# EAGLE schematic schema_12 (EAGLE 9.0.0)
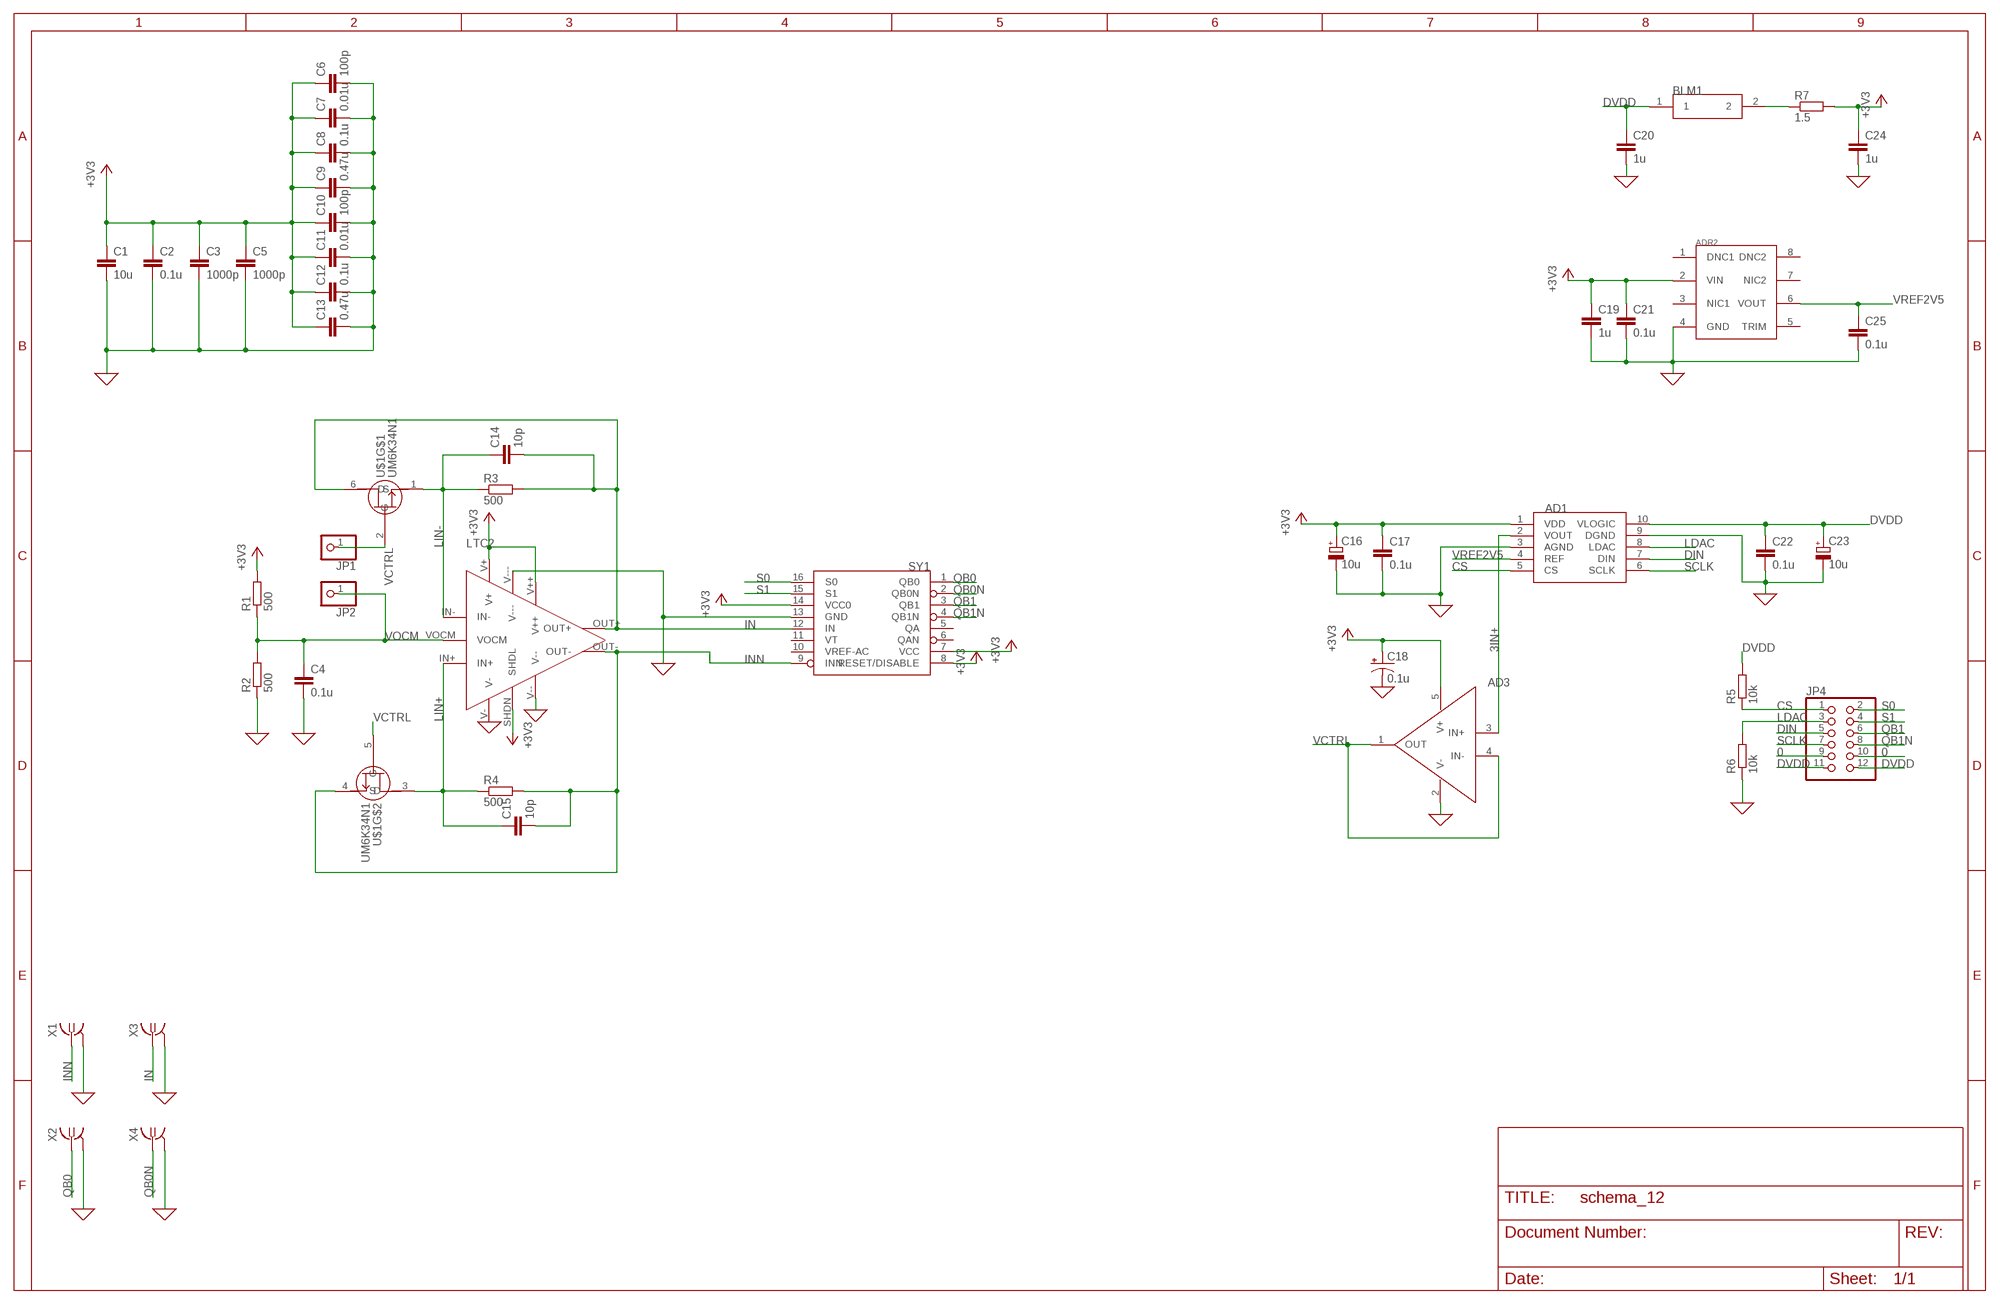
[diagram p0: schematic, sheet 1]

## Parts
AD1  0  AD5541AN  [SOP50P490X110-10]
AD3  0  AD8605N  [SOT95P280X145-5]
ADR2  ADR441N  [SOIC127P600X175-8]
BLM1  0  BLM18EG221TN1D  [C1608]
C1  10u  C-EUC1210  [C1210]
C2  0.1u  C-EUC0603  [C0603]
C3  1000p  C-EUC1206  [C1206]
C4  0.1u  C-EUC0603  [C0603]
C5  1000p  C-EUC1206  [C1206]
C6  100p  C-EUC0805  [C0805]
C7  0.01u  C-EUC1808  [C1808]
C8  0.1u  C-EUC0603  [C0603]
C9  0.47u  C-EUC1210  [C1210]
C10  100p  C-EUC0805  [C0805]
C11  0.01u  C-EUC1808  [C1808]
C12  0.1u  C-EUC0603  [C0603]
C13  0.47u  C-EUC1210  [C1210]
C14  10p  C-EUC0603  [C0603]
C15  10p  C-EUC0603  [C0603]
C16  10u  CPOL-EU153CLV-0405  [153CLV-0405]
C17  0.1u  C-EUC0603  [C0603]
C18  0.1u  CPOL-US153CLV-0405  [153CLV-0405]
C19  1u  C-EUC0603  [C0603]
C20  1u  C-EUC0603  [C0603]
C21  0.1u  C-EUC0603  [C0603]
C22  0.1u  C-EUC0603  [C0603]
C23  10u  CPOL-EU153CLV-0405  [153CLV-0405]
C24  1u  C-EUC0603  [C0603]
C25  0.1u  C-EUC0603  [C0603]
JP1  0  PINHD-1X1  [1X01]
JP2  0  PINHD-1X1  [1X01]
JP4  0  PINHD-2X6/90  [2X06/90]
LTC2  0  LTC6409_1  [LTC6409_1]
R1  500  R-EU_R0603  [R0603]
R2  500  R-EU_R0603  [R0603]
R3  500  R-EU_R0603  [R0603]
R4  500  R-EU_R0603  [R0603]
R5  10k  R-EU_R0805  [R0805]
R6  10k  R-EU_R0805  [R0805]
R7  1.5  R-EU_R0805  [R0805]
SY1  SY89873LN  [QFN50P300X300X90-16]
U$1  UM6K34N1  [SOTFL65P210X100-6]
X1  SMA-142-0701-871/880  [SMA-142-0701-871]
X2  SMA-142-0701-871/880  [SMA-142-0701-871]
X3  SMA-142-0701-871/880  [SMA-142-0701-871]
X4  SMA-142-0701-871/880  [SMA-142-0701-871]

## Nets
0: AD1.3(AGND) AD1.9(DGND) AD3.2(V-) ADR2.4(GND) C1.2 C2.2 C3.2 C4.2 C5.2 C6.2 C7.2 C8.2 C9.2 C10.2 C11.2 C12.2 C13.2 C16.- C17.2 C18.- C19.2 C20.2 C21.2 C22.2 C23.- C24.2 C25.2 JP4.9 JP4.10 LTC2.V- LTC2.V-- LTC2.V--- R2.1 R6.1 SY1.13(GND) X1.2@1 X1.2@2 X1.2@3 X1.2@4 X2.2@1 X2.2@2 X2.2@3 X2.2@4 X3.2@1 X3.2@2 X3.2@3 X3.2@4 X4.2@1 X4.2@2 X4.2@3 X4.2@4 ; supply symbol labelled GND
3IN+: AD1.2(VOUT) AD3.3(IN+)
+3V3: AD1.1(VDD) AD3.5(V+) ADR2.2(VIN) C1.1 C2.1 C3.1 C5.1 C6.1 C7.1 C8.1 C9.1 C10.1 C11.1 C12.1 C13.1 C16.+ C17.1 C18.+ C19.1 C21.1 C24.1 LTC2.SHDN(SHDL) LTC2.V+ LTC2.V++ R1.2 R7.2 SY1.7(VCC) SY1.8(RESET/DISABLE) SY1.14(VCC0)
CS: AD1.5(CS) JP4.1 R5.1
DIN: AD1.7(DIN) JP4.5
DVDD: AD1.10(VLOGIC) BLM1.1 C20.1 C22.1 C23.+ JP4.11 JP4.12 R5.2
IN: C14.2 LTC2.OUT+ R3.2 SY1.12(IN) U$1.6(D) X3.1
INN: C15.2 LTC2.OUT- R4.2 SY1.9(INN) U$1.4(S) X1.1
LDAC: AD1.8(LDAC) JP4.3 R6.2
LIN+: C15.1 LTC2.IN+ R4.1 U$1.3(D)
LIN-: C14.1 LTC2.IN- R3.1 U$1.1(S)
N$7: BLM1.2 R7.1
QB0: SY1.1(QB0) X2.1
QB0N: SY1.2(QB0N) X4.1
QB1: JP4.6 SY1.3(QB1)
QB1N: JP4.8 SY1.4(QB1N)
S0: JP4.2 SY1.16(S0)
S1: JP4.4 SY1.15(S1)
SCLK: AD1.6(SCLK) JP4.7
VCTRL: AD3.1(OUT) AD3.4(IN-) JP1.1 U$1.2(G) U$1.5(G)
VOCM: C4.1 JP2.1 LTC2.VOCM R1.1 R2.2
VREF2V5: AD1.4(REF) ADR2.6(VOUT) C25.1
Unconnected: ADR2.1(DNC1) ADR2.3(NIC1) ADR2.5(TRIM) ADR2.7(NIC2) ADR2.8(DNC2) SY1.5(QA) SY1.6(QAN) SY1.10(VREF-AC) SY1.11(VT)

## Library data of the parts
AD1 = mylibrary:AD5541A
AD3 = mylibrary:AD8605
ADR2 = mylibrary:ADR441
BLM1 = mylibrary:BLM18EG221TN1D: https://www.tme.eu/en/details/blm18eg221tn1d/ferrite-beads/murata/
C1-C3 C5-C13 = rcl:C-EU: CAPACITOR, European symbol
C4 C14 C15 C17 C19-C22 C24 C25 = rcl:C-EU: CAPACITOR, European symbol; SPICEPREFIX: C
C16 C23 = resistor:CPOL-EU: POLARIZED CAPACITOR, European symbol
C18 = rcl:CPOL-US: POLARIZED CAPACITOR, American symbol; SPICEPREFIX: C
JP1 JP2 = pinhead:PINHD-1X1: PIN HEADER
JP4 = pinhead:PINHD-2X6: PIN HEADER
LTC2 = mylibrary:LTC6409_1
R1 R2 R5-R7 = rcl:R-EU_: RESISTOR, European symbol; SPICEPREFIX: R
R3 R4 = resistor:R-EU_: RESISTOR, European symbol
SY1 = mylibrary:SY89873L
U$1 = mylibrary:UM6K34N1
X1-X4 = con-coax:SMA-: SMA 50 Ohm End Launch Jack Receptacle - Round Contact Johnson Components Source: www.johnsoncomponents.com .. J502-ND.pdf; MF: JOHNSON COMPONENTS; MPN: 142-0701-871; OC_FARNELL: 1339835; OC_NEWARK: 91B6105